# Altium schematic sheet Programmer.schdoc
size 207 x 126 mm
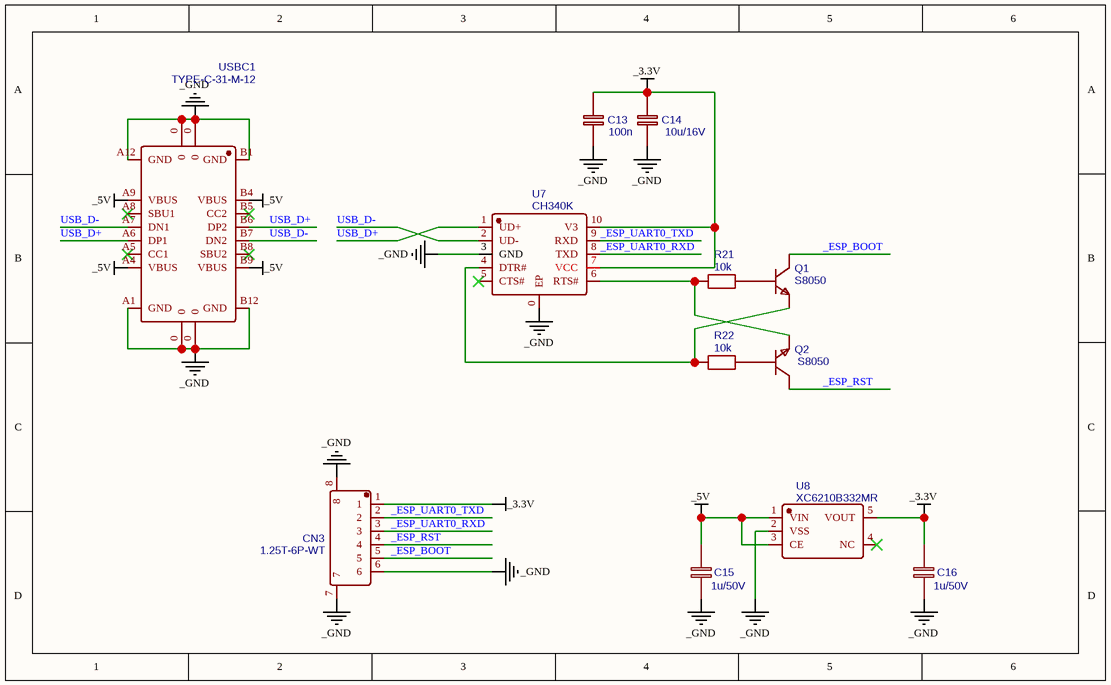
[diagram p0: Programmer.schdoc]

## Parts
C13  100n  [C0603_SMALL]
C14  10u/16V  [C0603_SMALL]
C15  1u/50V  [C0603_SMALL]
C16  1u/50V  [C0603_SMALL]
CN3  1.25T-6P-WT  [CONN-SMD_6P-P1.25_1.25T-6P-WT]
Q1  S8050  [SOT-23-3_L2.9-W1.3-P1.90-LS2.4-BR]
Q2  S8050  [SOT-23-3_L2.9-W1.3-P1.90-LS2.4-BR]
R21  10k  [R0603_SMALL]
R22  10k  [R0603_SMALL]
U7  CH340K  [ESOP-10_L4.9-W3.9-P1.00-LS6.2-BL-EP]
U8  XC6210B332MR  [SOT-23-5_L3.0-W1.7-P0.95-LS2.8-BR]
USBC1  TYPE-C-31-M-12  [USB-C_SMD-TYPE-C-31-M-12]

## Nets
_3.3V: C13.2 C14.2 C16.2 CN3.1 U7.7(VCC) U7.10(V3) U8.5(VOUT)
_5V: C15.2 U8.1(VIN) U8.3(CE) USBC1.A4(VBUS) USBC1.A9(VBUS) USBC1.B4(VBUS) USBC1.B9(VBUS)
_GND: C13.1 C14.1 C15.1 C16.1 CN3.6 CN3.7 CN3.8 U7.0(EP) U7.3(GND) U8.2(VSS) USBC1.0 USBC1.A1(GND) USBC1.A12(GND) USBC1.B1(GND) USBC1.B12(GND)
_ESP_BOOT: CN3.5 Q1.3(C)
_ESP_RST: CN3.4 Q2.3(C)
_ESP_UART0_RXD: CN3.3 U7.8(TXD)
_ESP_UART0_TXD: CN3.2 U7.9(RXD)
USB_D+: U7.1(UD+) USBC1.A6(DP1) USBC1.B6(DP2)
USB_D-: U7.2(UD-) USBC1.A7(DN1) USBC1.B7(DN2)
NetQ1_1: Q1.1(B) R21.1
NetQ1_2: Q1.2(E) R22.2 U7.4(DTR#)
NetQ2_1: Q2.1(B) R22.1
NetQ2_2: Q2.2(E) R21.2 U7.6(RTS#)

Not connected (* = marked no-connect by the designer): U7 5(CTS#)*; U8 4(NC)*; USBC1 A5(CC1)* A8(SBU1)* B5(CC2)* B8(SBU2)*

## Library data of the parts
C13 = 100n: BOM_Manufacturer Part: CC0603KRX7R9BB104; BOM_Manufacturer: YAGEO; nameAlias: Value(F); spicePre: C; spiceSymbolName: Cap_0603_EU; BOM_Supplier Part: C14663; BOM_Supplier: LCSC
C14 = 10u/16V: BOM_Manufacturer Part: CL10A106KP8NNNC; BOM_Manufacturer: SAMSUNG; nameAlias: Value(F); spicePre: C; spiceSymbolName: Cap_0603_EU; BOM_Supplier Part: C19702; BOM_Supplier: LCSC
C15 C16 = 1u/50V: BOM_Manufacturer Part: CL10A105KB8NNNC; BOM_Manufacturer: SAMSUNG; nameAlias: Value(F); Contributor: LCEDA_Lib; BOM_Supplier Part: C15849; BOM_Supplier: LCSC; spicePre: C; spiceSymbolName: C_0603_EU
CN3 = 1.25T-6P-WT: BOM_Manufacturer: HRO; BOM_Supplier: LCSC; BOM_Manufacturer Part: 1.25T-6P-WT; BOM_Supplier Part: C97377; BOM_JLCPCB Part Class: Extended Part; spicePre: C; spiceSymbolName: 1.25T-6P-WT
Q1 Q2 = S8050: BOM_Manufacturer: CJ; Contributor: 立创EDA官方封装库; BOM_Supplier: LCSC; BOM_Manufacturer Part: S8050; BOM_Supplier Part: C2146; spicePre: Q; spiceSymbolName: S8050-C139514
R21 R22 = 10k: BOM_Manufacturer Part: 0603WAF1002T5E; BOM_Manufacturer: UniOhm; nameAlias: Value(Ω); Contributor: LCEDA_Lib; BOM_Supplier Part: C25804; BOM_Supplier: LCSC; spicePre: R; spiceSymbolName: R_0603_EU
U7 = CH340K: BOM_Manufacturer: 南京沁恒; Contributor: 矛盾聚合体; BOM_Supplier: LCSC; BOM_Supplier Part: CH340K; BOM_Manufacturer Part: CH340K; spicePre: U; spiceSymbolName: CH340K
U8 = XC6210B332MR: BOM_Manufacturer: Torex Semicon; Contributor: LCSC; BOM_Supplier: LCSC; BOM_Supplier Part: C424705; BOM_Manufacturer Part: XC6210B332MR; BOM_JLCPCB Part Class: Extended Part; spicePre: U; spiceSymbolName: ME6214C33M5G
USBC1 = TYPE-C-31-M-12: BOM_Manufacturer: Rectangular Connectors - Contacts; Contributor: LCSC; BOM_Supplier: LCSC; BOM_Supplier Part: C165948; BOM_Manufacturer Part: TYPE-C-31-M-12; spicePre: U; spiceSymbolName: TYPE-C-31-M-12